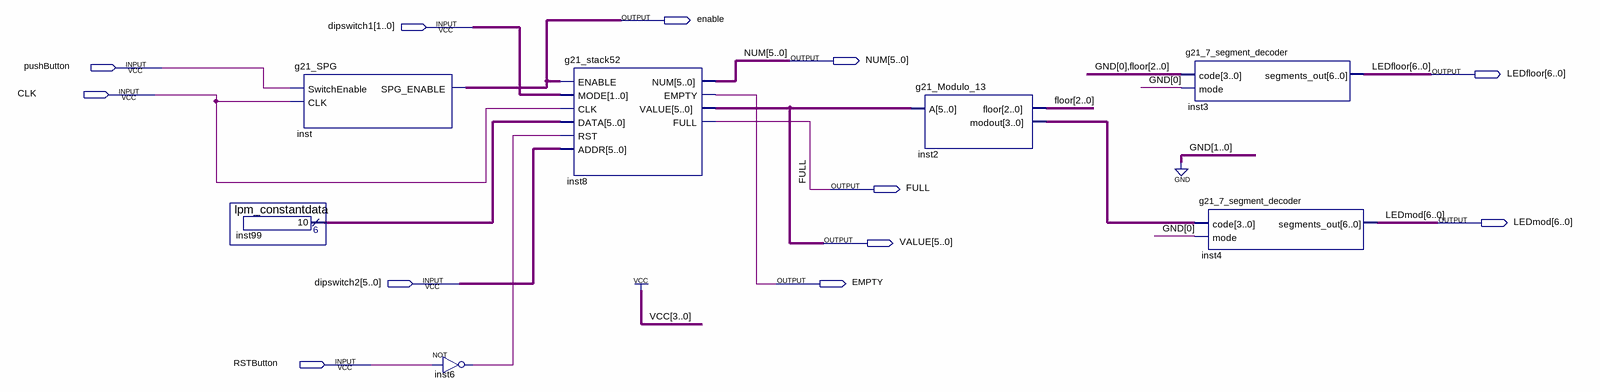
[diagram p0: schematic sheet]
// Quartus schematic g21_test_bed.bdf as structural Verilog: 7 symbols, 12 pins
module g21_test_bed (
  input  [1:0] dipswitch1,
  input  pushButton,
  input  CLK,
  input  [5:0] dipswitch2,
  input  RSTButton,
  output enable,
  output [5:0] NUM,
  output [6:0] LEDfloor,
  output FULL,
  output [6:0] LEDmod,
  output [5:0] VALUE,
  output EMPTY
);

  wire inst6_out;
  wire [2:0] floor;
  wire [3:0] inst2_modout;
  wire [5:0] inst99_result;

  lpm_constantdata inst99 (.result(inst99_result));
  g21_SPG inst (.SwitchEnable(pushButton), .CLK(CLK), .SPG_ENABLE(enable));
  not inst6 (inst6_out, RSTButton);
  g21_stack52 inst8 (
    .ENABLE(enable), .MODE(dipswitch1), .CLK(CLK), .DATA(inst99_result), .RST(inst6_out), .ADDR(dipswitch2),
    .NUM(NUM), .EMPTY(EMPTY), .VALUE(VALUE), .FULL(FULL));
  g21_Modulo_13 inst2 (.A(VALUE), .floor(floor), .modout(inst2_modout));
  g21_7_segment_decoder inst3 (.code({1'b0, floor}), .mode(1'b0), .segments_out(LEDfloor));
  g21_7_segment_decoder inst4 (.code(inst2_modout), .mode(1'b0), .segments_out(LEDmod));
endmodule
